# Altium schematic sheet ad.SchDoc
size A3
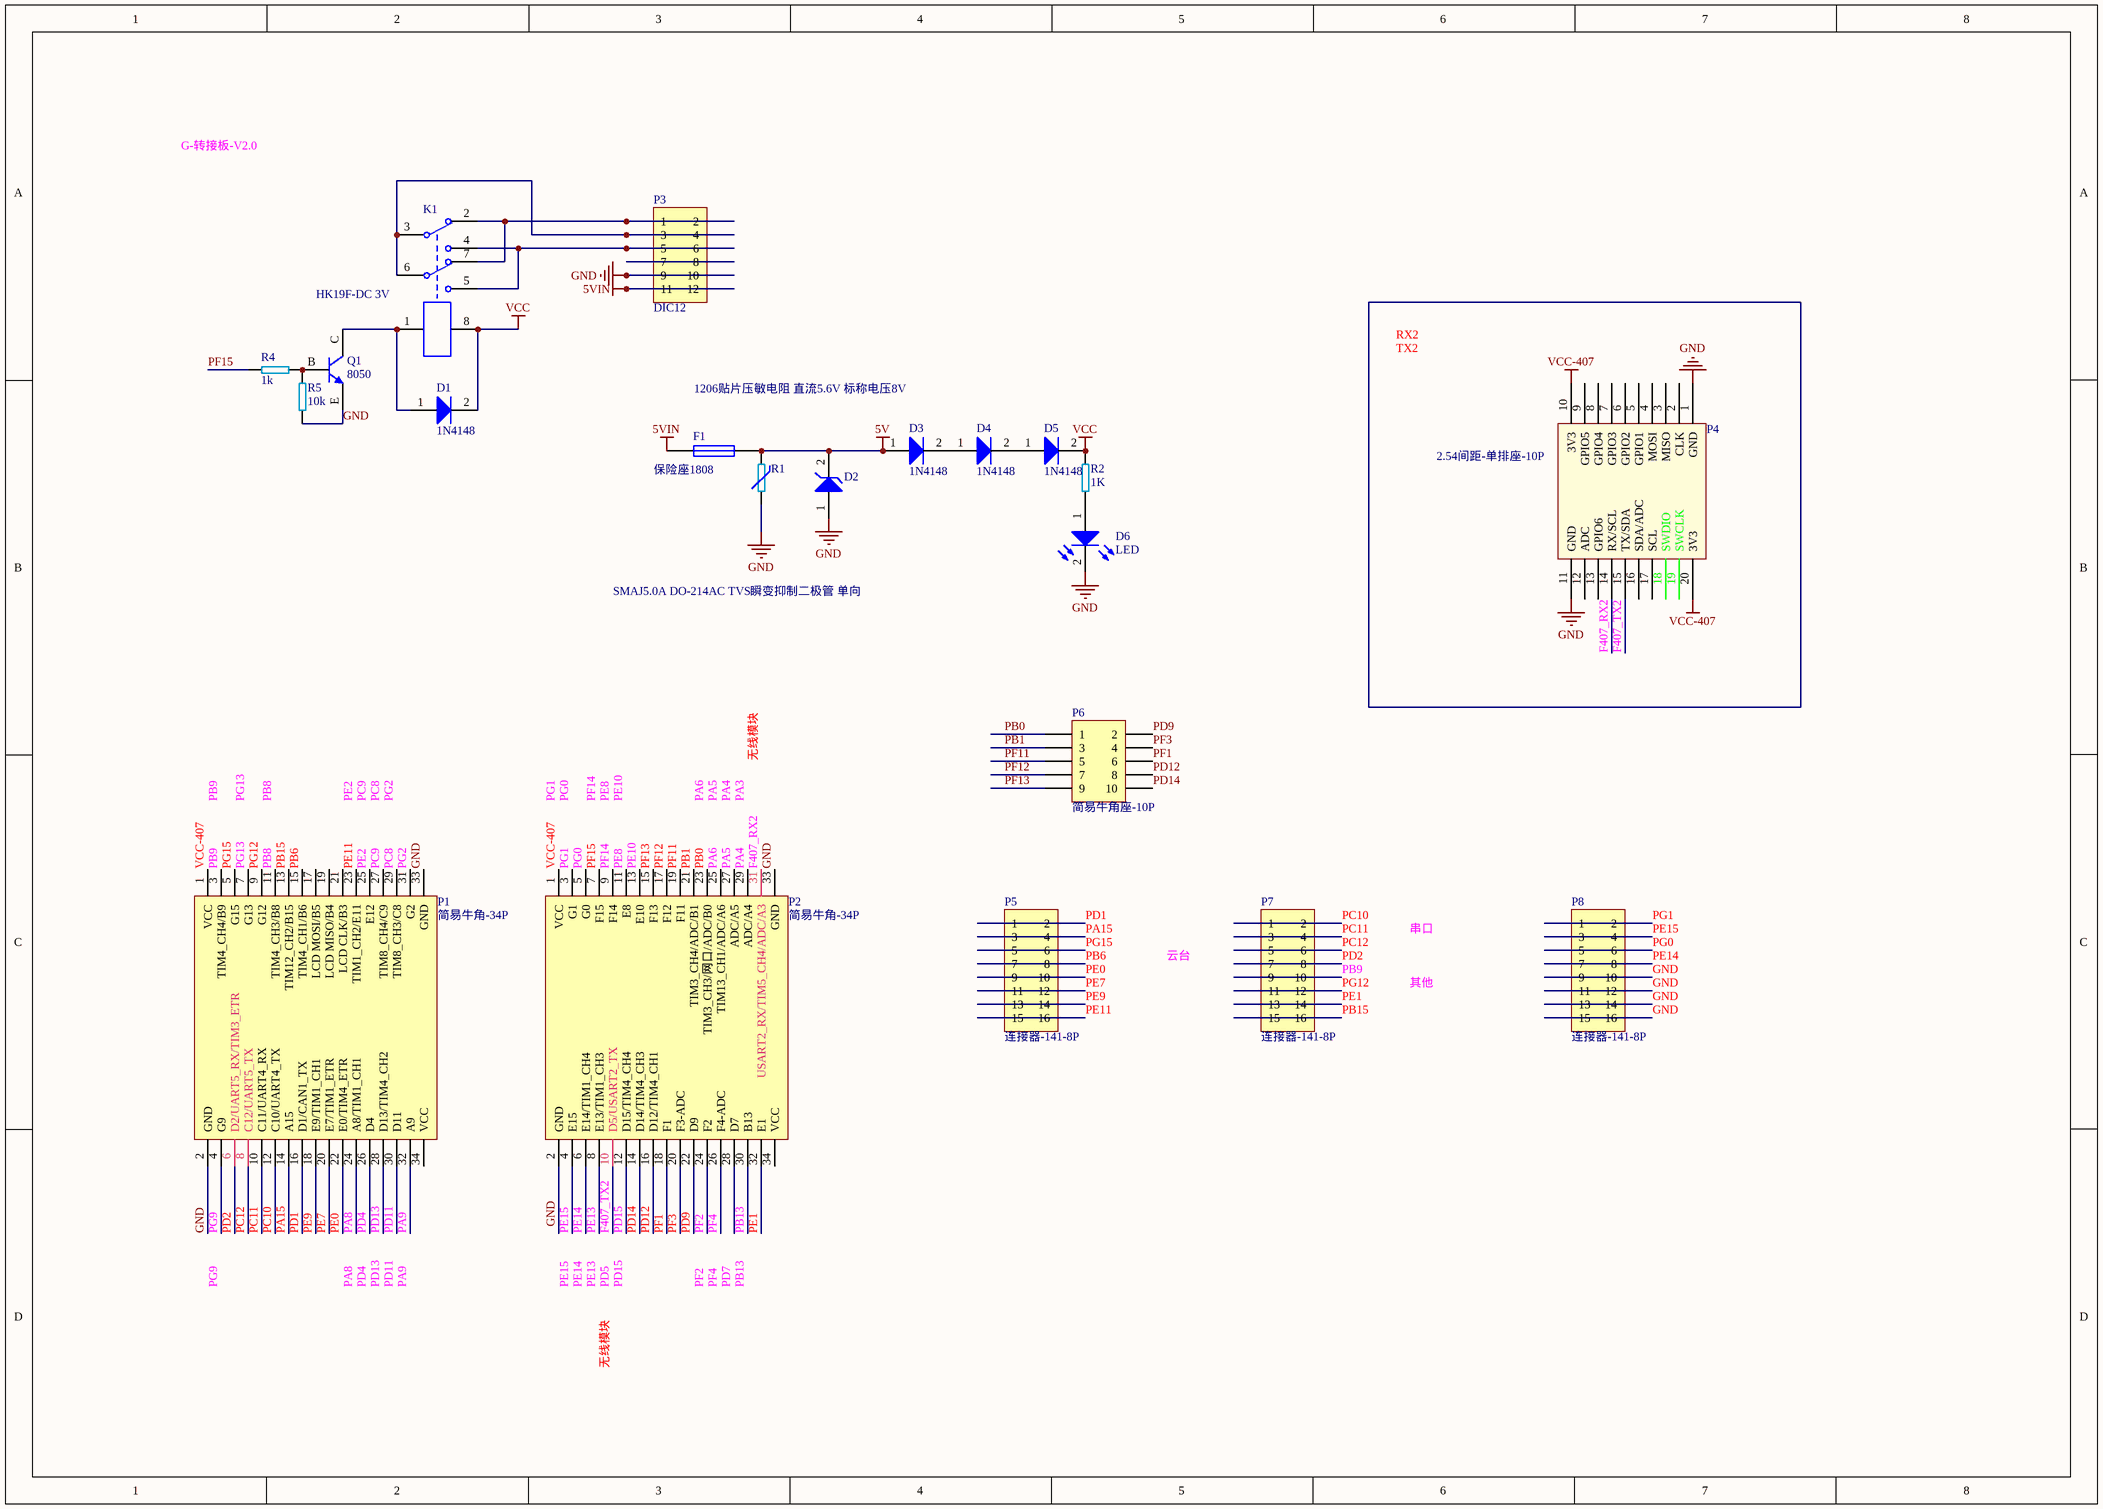
[diagram p0: ad.SchDoc]

## Parts
D1  1N4148  [SOD123]
D2  SMAJ5.0A DO-214AC TVS瞬变抑制二极管 单向  [SMA]
D3  1N4148  [SOD123]
D4  1N4148  [SOD123]
D5  1N4148  [SOD123]
D6  LED  [LED0603]
F1  保险座1808  [F1808-ZUO]
K1  HK19F-DC 3V  [HK19F]
P1  简易牛角-34P  [IDC2.54-LI-2x17P]
P2  简易牛角-34P  [IDC2.54-LI-2x17P]
P3  DIC12  [141V-6P]
P4  2.54间距-单排座-10P  [SIP20-2-MODE]
P5  连接器-141-8P  [141V-8P]
P6  简易牛角座-10P  [IDC2.54-LI-10P]
P7  连接器-141-8P  [141V-8P]
P8  连接器-141-8P  [141V-8P]
Q1  8050  [SOT-23]
R1  1206贴片压敏电阻 直流5.6V 标称电压8V  [R1206]
R2  1K  [R0603]
R4  1k  [R0603]
R5  10k  [R0603]

## Nets
5V: D2.2 D3.1(A) F1.2 R1.2
5VIN: F1.1 P3.11 P3.12
GND: D2.1 D6.2(K) P1.2(GND) P1.33(GND) P2.2(GND) P2.33(GND) P3.9 P3.10 P4.1(GND) P4.11(GND) P8.9 P8.10 P8.11 P8.12 P8.13 P8.14 P8.15 P8.16 Q1.E R1.1 R5.1
VCC: D1.2(K) D5.2(K) K1.8 R2.2
VCC-407: P1.1(VCC) P2.1(VCC) P4.10(3V3) P4.20(3V3)
F407_RX2: P2.31(USART2_RX/TIM5_CH4/ADC/A3) P4.14(RX/SCL)
F407_TX2: P2.10(D5/USART2_TX) P4.15(TX/SDA)
PA4: P2.29(ADC/A4)
PA5: P2.27(ADC/A5)
PA6: P2.25(TIM13_CH1/ADC/A6)
PA8: P1.24(A8/TIM1_CH1)
PA9: P1.32(A9)
PA15: P1.14(A15) P5.3 P5.4
PB0: P2.23(TIM3_CH3/网口/ADC/B0) P6.1
PB1: P2.21(TIM3_CH4/ADC/B1) P6.3
PB6: P1.15(TIM4_CH1/B6) P5.7 P5.8
PB8: P1.11(TIM4_CH3/B8)
PB9: P1.3(TIM4_CH4/B9) P7.9 P7.10
PB13: P2.30(B13)
PB15: P1.13(TIM12_CH2/B15) P7.15 P7.16
PC8: P1.29(TIM8_CH3/C8)
PC9: P1.27(TIM8_CH4/C9)
PC10: P1.12(C10/UART4_TX) P7.1 P7.2
PC11: P1.10(C11/UART4_RX) P7.3 P7.4
PC12: P1.8(C12/UART5_TX) P7.5 P7.6
PD1: P1.16(D1/CAN1_TX) P5.1 P5.2
PD2: P1.6(D2/UART5_RX/TIM3_ETR) P7.7 P7.8
PD4: P1.26(D4)
PD9: P2.22(D9) P6.2
PD11: P1.30(D11)
PD12: P2.16(D12/TIM4_CH1) P6.8
PD13: P1.28(D13/TIM4_CH2)
PD14: P2.14(D14/TIM4_CH3) P6.10
PD15: P2.12(D15/TIM4_CH4)
PE0: P1.22(E0/TIM4_ETR) P5.9 P5.10
PE1: P2.32(E1) P7.13 P7.14
PE2: P1.25(E12)
PE7: P1.20(E7/TIM1_ETR) P5.11 P5.12
PE8: P2.11(E8)
PE9: P1.18(E9/TIM1_CH1) P5.13 P5.14
PE10: P2.13(E10)
PE11: P1.23(TIM1_CH2/E11) P5.15 P5.16
PE13: P2.8(E13/TIM1_CH3)
PE14: P2.6(E14/TIM1_CH4) P8.7 P8.8
PE15: P2.4(E15) P8.3 P8.4
PF1: P2.18(F1) P6.6
PF2: P2.24(F2)
PF3: P2.20(F3-ADC) P6.4
PF4: P2.26(F4-ADC)
PF11: P2.19(F11) P6.5
PF12: P2.17(F12) P6.7
PF13: P2.15(F13) P6.9
PF14: P2.9(F14)
PF15: P2.7(F15) R4.1
PG0: P2.5(G0) P8.5 P8.6
PG1: P2.3(G1) P8.1 P8.2
PG2: P1.31(G2)
PG9: P1.4(G9)
PG12: P1.9(G12) P7.11 P7.12
PG13: P1.7(G13)
PG15: P1.5(G15) P5.5 P5.6
NetD1_1: D1.1(A) K1.1 Q1.C
NetD3_2: D3.2(K) D4.1(A)
NetD4_2: D4.2(K) D5.1(A)
NetD6_1: D6.1(A) R2.1
NetK1_2: K1.2 K1.7 P3.1 P3.2
NetK1_3: K1.3 K1.6 P3.3 P3.4
NetK1_4: K1.4 K1.5 P3.5 P3.6
NetP3_7: P3.7 P3.8
NetQ1_B: Q1.B R4.2 R5.2

Not connected (* = marked no-connect by the designer): P1 17(LCD_MOSI/B5) 19(LCD_MISO/B4) 21(LCD_CLK/B3) 34(VCC); P2 28(D7) 34(VCC); P4 2(CLK) 3(MISO) 4(MOSI) 5(GPIO1) 6(GPIO2) 7(GPIO3) 8(GPIO4) 9(GPIO5) 12(ADC) 13(GPIO6) 16(SDA/ADC) 17(SCL) 18(SWDIO) 19(SWCLK)

## Notes on the sheet
- Labels drawn without touching a wire or pin: G-转接板-V2.0, PA3, PA4, PA5, PA6, PA8, PA9, PB8, PB9, PB13, PC8, PC9, PD4, PD5, PD7, PD11, PD13, PD15, PE2, PE8, PE10, PE13, PE14, PE15, PF2, PF4, PF14, PG0, PG1, PG2, PG9, PG13, RX2, TX2, 串口, 云台, 其他, 无线模块

## Library data of the parts
D1 = DD: High Conductance Fast Diode; Published: 8-Jun-2000; LatestRevisionDate: 17-Jul-2002; LatestRevisionNote: Re-released for DXP Platform.; DatasheetVersion: 1997; PackageReference: DO-35; Publisher: Altium Limited; PackageDescription: Diode, Axial; Body 3.8 x 1.9 mm (LxDia. max), Lead Dia. 0.53 mm (max); Code_JEDEC: DO-204-AH; ComponentLink1Description: Manufacturer Link; ComponentLink1URL: http://www.fairchildsemi.com/; ComponentLink2Description: Datasheet; ComponentLink2URL: http://www.fairchildsemi.com/ds/1N%2F1N4448.pdf
D2 = TVS-SMA: 稳压管; Published: 8-Jun-2000; LatestRevisionDate: 17-Jul-2002; LatestRevisionNote: Re-released for DXP Platform.; DatasheetVersion: 1997; PackageReference: DO-35; Publisher: Altium Limited; PackageDescription: Diode, Axial; Body 3.8 x 1.9 mm (LxDia. max), Lead Dia. 0.53 mm (max); Code_JEDEC: DO-204-AH; ComponentLink1Description: Manufacturer Link; ComponentLink1URL: http://www.fairchildsemi.com/; ComponentLink2Description: Datasheet; ComponentLink2URL: http://www.fairchildsemi.com/ds/1N%2F1N4448.pdf
D3-D5 = DD: 二极管; Published: 8-Jun-2000; LatestRevisionDate: 17-Jul-2002; LatestRevisionNote: Re-released for DXP Platform.; DatasheetVersion: 1997; PackageReference: DO-35; Publisher: Altium Limited; PackageDescription: Diode, Axial; Body 3.8 x 1.9 mm (LxDia. max), Lead Dia. 0.53 mm (max); Code_JEDEC: DO-204-AH; ComponentLink1Description: Manufacturer Link; ComponentLink1URL: http://www.fairchildsemi.com/; ComponentLink2Description: Datasheet; ComponentLink2URL: http://www.fairchildsemi.com/ds/1N%2F1N4448.pdf
D6 = LED0603: Published: 8-Jun-2000; LatestRevisionDate: 08-Jul-2005; LatestRevisionNote: Mech Layer 1 removed.; PackageReference: LED-0; Publisher: Altium Limited; PackageDescription: LED; 2 Leads
F1 = Fuse0805: 保险座; Published: 8-Jun-2000; LatestRevisionDate: 17-Jul-2002; LatestRevisionNote: Re-released for DXP Platform.; PackageReference: PIN-W2/E2.8; Publisher: Altium Limited; PackageDescription: Thru-Hole; 2 Leads
K1 = Relay-DPDT: Dual-Pole Dual-Throw Relay; Published: 24-Mar-1999; LatestRevisionDate: 17-Jul-2002; LatestRevisionNote: Re-released for DXP Platform.; PackageReference: DIP-P8; Publisher: Altium Limited; PackageDescription: Relay; 8 Leads
P1 = STM32F407-L: 双排插座2.54间距-34P-带边框
P2 = STM32F407-R: 双排插座2.54间距-34P-带边框
P3 = DIC12: 连接器; LatestRevisionDate: 17-Jul-2002; LatestRevisionNote: Re-released for DXP Platform.; Publisher: Altium Limited
P4 = PM-20-D: 单排针-10P
P5 P7 P8 = DIC16: 连接器; LatestRevisionDate: 17-Jul-2002; LatestRevisionNote: Re-released for DXP Platform.; Publisher: Altium Limited
P6 = DIC10: 连接器; LatestRevisionDate: 17-Jul-2002; LatestRevisionNote: Re-released for DXP Platform.; Publisher: Altium Limited
Q1 = 8050: NPN Bipolar Transistor; Published: 8-Jun-2000; LatestRevisionDate: 17-Jul-2002; LatestRevisionNote: Re-released for DXP Platform.; PackageReference: TO-226-AA; Publisher: Altium Limited; PackageDescription: TO, Flat Index; 3 In-Line, Axial Leads; Body Dia. 4.8mm; Leads 0.55 x 0.51 mm (max); Code_JEDEC: TO-226-AA
R1 = RV: 压敏电阻
R2 R5 = R-0603: 贴片电阻
R4 = R-0603